# EAGLE design powerboard (EAGLE 6.4)
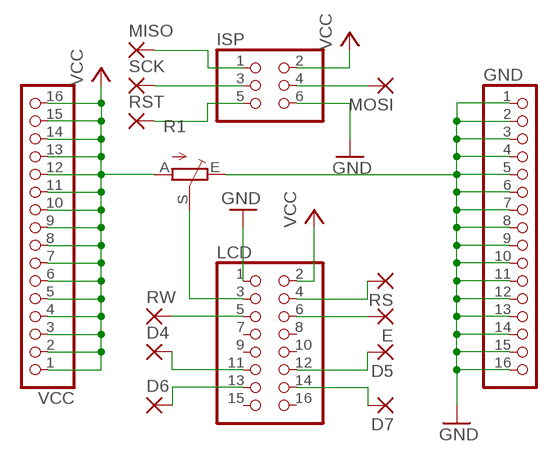
[diagram p0: schematic, sheet 1]

## Parts
D4  2,54/1,1  [2,54/1,1]
D5  2,54/1,1  [2,54/1,1]
D6  2,54/1,1  [2,54/1,1]
D7  2,54/1,1  [2,54/1,1]
E  2,54/1,1  [2,54/1,1]
GND  PINHD-1X16  [1X16]
ISP  PINHD-2X3  [2X03]
LCD  PINHD-2X8  [2X08]
MISO  2,54/1,1  [2,54/1,1]
MOSI  2,54/1,1  [2,54/1,1]
R1  TRIM_EU-LI10  [LI10]
RS  2,54/1,1  [2,54/1,1]
RST  2,54/1,1  [2,54/1,1]
RW  2,54/1,1  [2,54/1,1]
SCK  2,54/1,1  [2,54/1,1]
VCC  PINHD-1X16  [1X16]

## Nets
GND: GND.1 GND.2 GND.3 GND.4 GND.5 GND.6 GND.7 GND.8 GND.9 GND.10 GND.11 GND.12 GND.13 GND.14 GND.15 GND.16 ISP.6 LCD.1 R1.E
N$1: LCD.4 RS.1(P)
N$2: LCD.5 RW.1(P)
N$3: ISP.1 MISO.1(P)
N$4: ISP.3 SCK.1(P)
N$5: ISP.5 RST.1(P)
N$6: ISP.4 MOSI.1(P)
N$7: E.1(P) LCD.6
N$8: D4.1(P) LCD.11
N$9: D5.1(P) LCD.12
N$10: D6.1(P) LCD.13
N$11: D7.1(P) LCD.14
N$12: LCD.3 R1.S
VCC: ISP.2 LCD.2 R1.A VCC.1 VCC.2 VCC.3 VCC.4 VCC.5 VCC.6 VCC.7 VCC.8 VCC.9 VCC.10 VCC.11 VCC.12 VCC.13 VCC.14 VCC.15 VCC.16
Unconnected: LCD.7 LCD.8 LCD.9 LCD.10 LCD.15 LCD.16

## Library data of the parts
D4-D7 E MISO MOSI RS RST RW SCK = wirepad:2,54/1,1: THROUGH-HOLE PAD
GND VCC = pinhead:PINHD-1X16: PIN HEADER
ISP = pinhead:PINHD-2X3: PIN HEADER
LCD = pinhead:PINHD-2X8: PIN HEADER
R1 = pot:TRIM_EU-: POTENTIOMETER

## Net classes
0 default: width 0.508 mm, drill 0.254 mm, clearance 0.508 mm

## Board
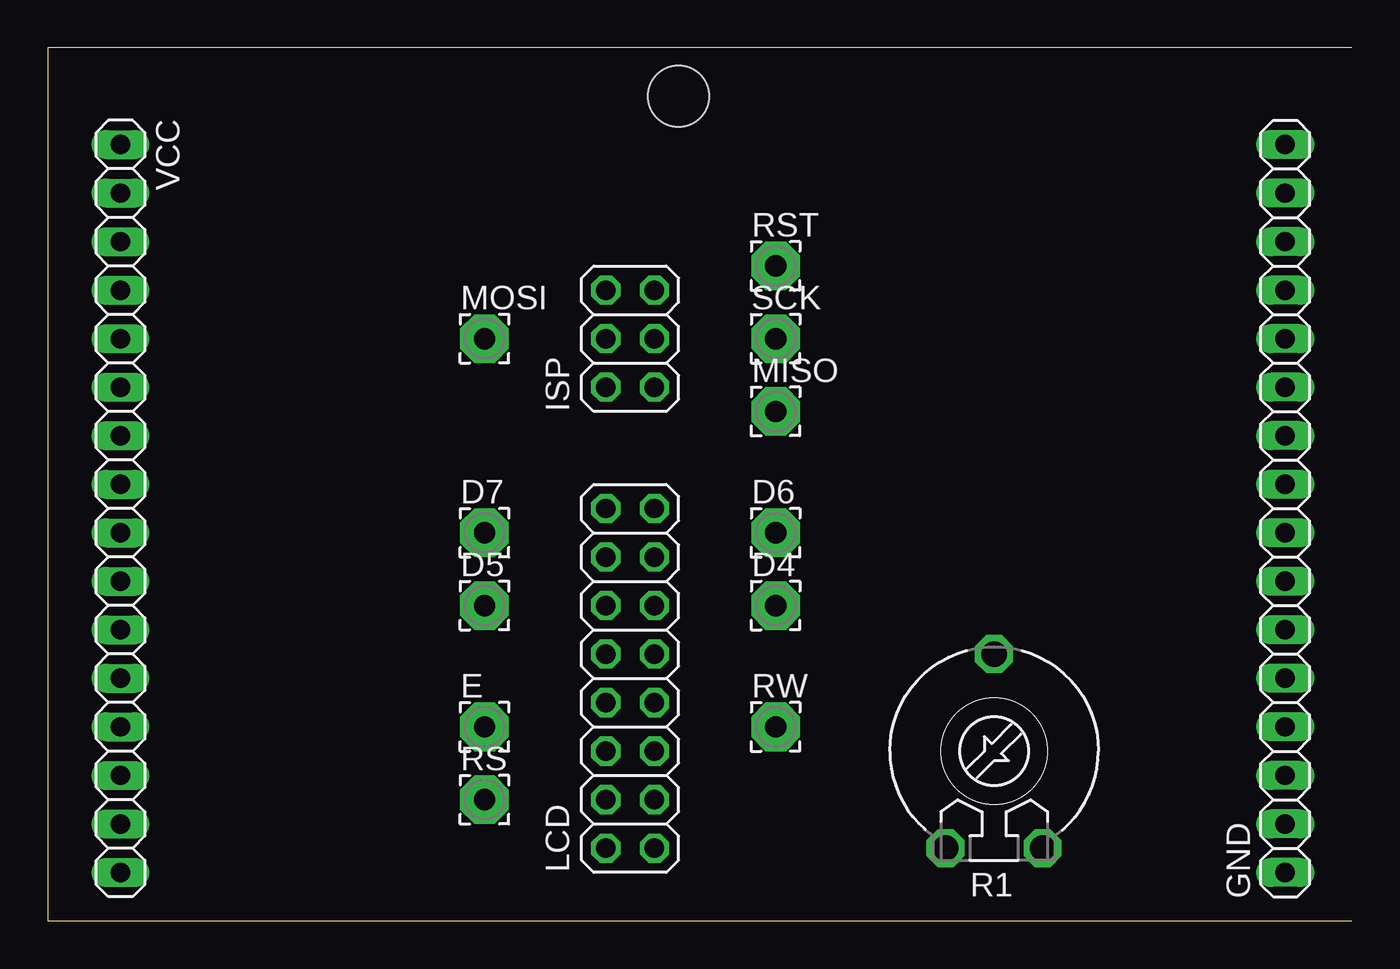
[diagram p1: board, top side]
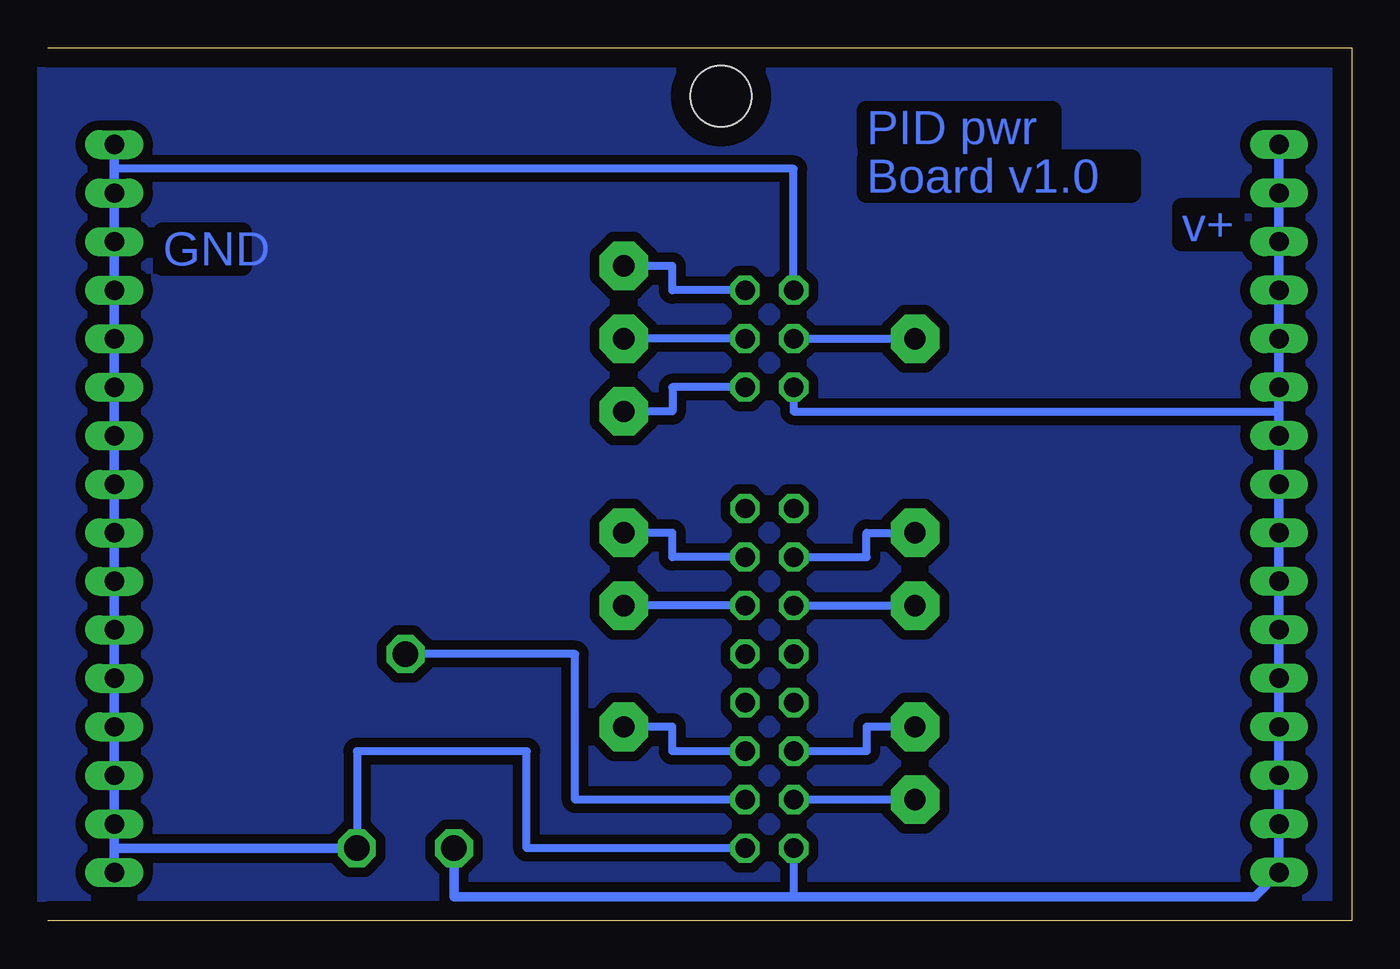
[diagram p2: board, bottom side, seen from below]

Size 68.25 x 45.71 mm. Coordinates in mm from the lower left corner, seen from the top.
Outline: 68.25,0 0,0 0,45.71 68.25,45.71
Copper layers (1*16): Top 0.035mm / dielectric 1.5mm / Bottom 0.035mm
Design rules "default": minimum track width 10mil, minimum drill 24mil, track to track 8mil, track to pad 8mil, pad to pad 8mil, via to via 8mil, smd to smd 8mil, copper to edge 40mil, drill to drill 8mil, minimum pad ring 10mil, minimum via ring 8mil, stop-mask expansion 4mil, vias tented up to drill 0mil, thermal gap 10mil
Holes 3.2 mm at 33.02,43.18

### Footprints (pad centres in the part's own frame; a part is rotated, then mirrored left to right if it is on the bottom)
2,54/1,1 = drill 1.118 pad 2.54 octagon: 1 0,0
1X16 = drill 1.016 long: 1 -19.05,0; 2 -16.51,0; 3 -13.97,0; 4 -11.43,0; 5 -8.89,0; 6 -6.35,0; 7 -3.81,0; 8 -1.27,0; 9 1.27,0; 10 3.81,0; 11 6.35,0; 12 8.89,0; 13 11.43,0; 14 13.97,0; 15 16.51,0; 16 19.05,0
2X03 = drill 1.016 octagon: 1 -2.54,-1.27; 2 -2.54,1.27; 3 0,-1.27; 4 0,1.27; 5 2.54,-1.27; 6 2.54,1.27
2X08 = drill 1.016 octagon: 1 -8.89,-1.27; 2 -8.89,1.27; 3 -6.35,-1.27; 4 -6.35,1.27; 5 -3.81,-1.27; 6 -3.81,1.27; 7 -1.27,-1.27; 8 -1.27,1.27; 9 1.27,-1.27; 10 1.27,1.27; 11 3.81,-1.27; 12 3.81,1.27; 13 6.35,-1.27; 14 6.35,1.27; 15 8.89,-1.27; 16 8.89,1.27
LI10 = drill 1.321 octagon: A -2.54,-5.08; E 2.54,-5.08; S 0,5.08

### Placement (x,y rotation side)
D4  38.1,16.51 0 top
D5  22.86,16.51 0 top
D6  38.1,20.32 0 top
D7  22.86,20.32 0 top
E  22.86,10.16 0 top
GND  64.77,21.59 90 top
ISP  30.48,30.48 90 top
LCD  30.48,12.7 90 top
MISO  38.1,26.67 0 top
MOSI  22.86,30.48 0 top
R1  49.53,8.89 0 top
RS  22.86,6.35 0 top
RST  38.1,34.29 0 top
RW  38.1,10.16 0 top
SCK  38.1,30.48 0 top
VCC  3.81,21.59 270 top

### Tracks (layer width: path | path; a pad name or v marks a point on that pad's centre or on a via)
GND
  Bottom 0.406: LCD.1 43.18,3.81 43.18,8.89 52.07,8.89 R1.E | ISP.6 29.21,39.37 64.77,39.37
  Bottom 0.508: GND.16 64.77,39.37 GND.15 GND.14 GND.13 GND.12 GND.11 GND.10 GND.9 GND.8 GND.7 GND.6 GND.5 GND.4 GND.3 GND.2 64.77,3.81 | 64.77,3.81 GND.1 | 64.77,3.81 R1.E
N$1
  Bottom 0.406: RS.1 LCD.4
N$2
  Bottom 0.406: LCD.5 35.56,8.89 35.56,10.16 RW.1
N$3
  Bottom 0.406: ISP.1 35.56,27.94 35.56,26.67 MISO.1
N$4
  Bottom 0.406: ISP.3 SCK.1
N$5
  Bottom 0.406: ISP.5 35.56,33.02 35.56,34.29 RST.1
N$6
  Bottom 0.406: ISP.4 MOSI.1
N$7
  Bottom 0.406: E.1 25.4,10.16 25.4,8.89 LCD.6
N$8
  Bottom 0.406: LCD.11 D4.1
N$9
  Bottom 0.406: LCD.12 D5.1
N$10
  Bottom 0.406: LCD.13 35.56,19.05 35.56,20.32 D6.1
N$11
  Bottom 0.406: LCD.14 25.4,19.05 25.4,20.32 D7.1
N$12
  Bottom 0.406: LCD.3 40.64,6.35 40.64,13.97 R1.S
N$13
  pour Bottom: 0,45.72 0,0 68.58,0 68.58,45.72
VCC
  Bottom 0.406: LCD.2 29.21,1.27 | ISP.2 29.21,26.67 3.81,26.67
  Bottom 0.508: VCC.1 VCC.2 VCC.3 VCC.4 VCC.5 VCC.6 3.81,26.67 VCC.7 VCC.8 VCC.9 VCC.10 VCC.11 VCC.12 VCC.13 VCC.14 VCC.15 VCC.16 5.08,1.27 29.21,1.27 46.99,1.27 R1.A
(copper drawn outside any net)
  shapes: Bottom circle x1

### Text on the board
Bottom: PID pwr | Board v1.0 | v+ | GND